# Altium schematic sheet SIM7600G-H_USB.SchDoc
size A; SheetNumber: 25; SheetTotal: 28
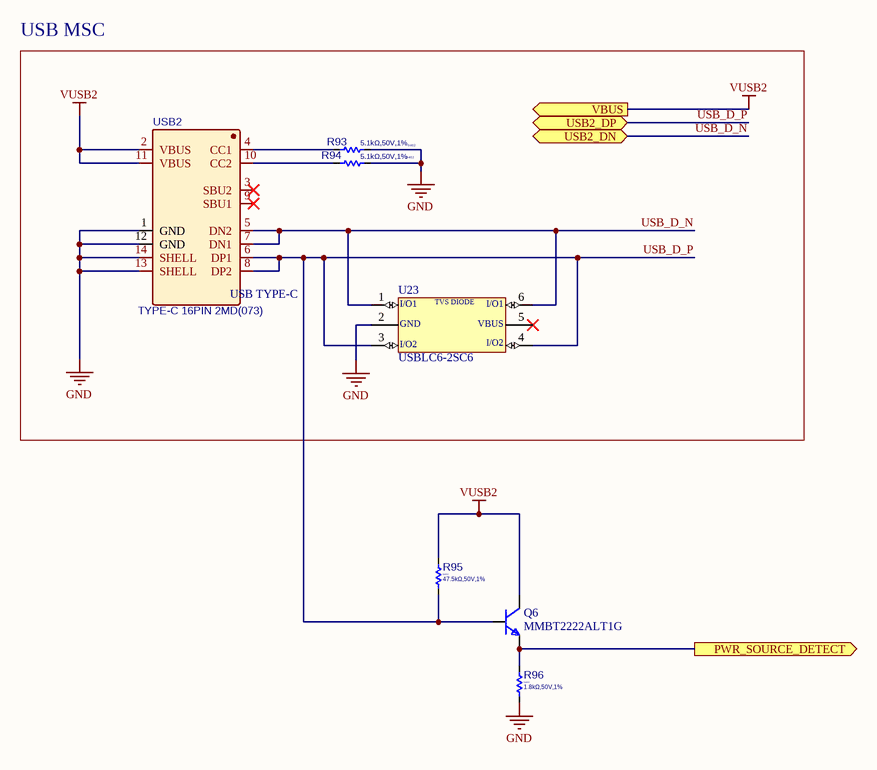
[diagram p0: SIM7600G-H_USB.SchDoc]

## Parts
Q6  MMBT2222ALT1G  [SOT-23]
R93  value 5.1kΩ,50V,1%  Package: 0402  [R0402]  (hidden comment: 5.1KΩ)
R94  value 5.1kΩ,50V,1%  Package: 0402  [R0402]  (hidden comment: 5.1KΩ)
R95  value 47.5kΩ,50V,1%  Package: 0402  [R0402]  (hidden comment: 47.5kΩ)
R96  value 1.8kΩ,50V,1%  Package: 0402  [R0402]  (hidden comment: 1.8kΩ)
U23  USBLC6-2SC6  [SOT95P280X145-6N]
USB2  TYPE-C 16PIN 2MD(073)  [TYPE-C 16PIN 2MD(073)]

## Blocks framed on the sheet
USB MSC: R93 R94 U23 USB2

## Ports
PWR_SOURCE_DETECT (out), USB2_DN (bidir), USB2_DP (bidir), VBUS (out)

## Nets
GND: R93.2 R94.2 R96.1 U23.2(GND) USB2.1(GND) USB2.12(GND) USB2.13(SHELL) USB2.14(SHELL)
VUSB2: Q6.3 R95.2 USB2.2(VBUS) USB2.11(VBUS) ; port VBUS
PWR_SOURCE_DETECT: Q6.2 R96.2 ; port PWR_SOURCE_DETECT
USB_D_N: U23.1(I/O1_IN) U23.6(I/O1_OUT) USB2.5(DN2) USB2.7(DN1) ; port USB2_DN
USB_D_P: Q6.1 R95.1 U23.3(I/O2_IN) U23.4(I/O2_OUT) USB2.6(DP1) USB2.8(DP2) ; port USB2_DP
NetR93_1: R93.1 USB2.4(CC1)
NetR94_1: R94.1 USB2.10(CC2)

Not connected (* = marked no-connect by the designer): U23 5(VBUS)*; USB2 3(SBU2)* 9(SBU1)*

## Notes on the sheet
- (in symbol TYPE-C 16PIN 2MD(073)) USB TYPE-C
- (in symbol USBLC6-2SC6) TVS DIODE; I/O1; I/O2

## Library data of the parts
Q6 = MMBT2222ALT1G: Bipolar (BJT) Transistor NPN 40 V 600 mA 300MHz 225 mW Surface Mount SOT-23-3 (TO-236); Manufacturer: ON Semiconductor; Max Operating Temp: +150°C; Min Operating Temp: -55°C; MPN: MMBT2222ALT1G; Package: SOT-23
R93 R94 = RC0402FR-075K1L: 100mW Thick Film Resistors 75V ±100ppm/℃ ±1% 100kΩ 0603 Chip Resistor - Surface Mount ROHS; Manufacturer: YAGEO; Max Operating Temp: +155; MPN: RC0402FR-075K1L; Type: *; Datasheet: https://datasheet.lcsc.com/lcsc/2304140030_YAGEO-RC0402FR-075K1L_C105872.pdf; Min Operating Temp: -55; LCSC: C105872
R95 = AC0402FR-0747K5L: 62.5mW Thick Film Resistors 50V ±100ppm/℃ ±1% 47.5kΩ 0402 Chip Resistor - Surface Mount ROHS; Manufacturer: YAGEO(国巨); Type: *; MPN: AC0402FR-0747K5L; Max Operating Temp: +155; Min Operating Temp: -55; Datasheet: https://datasheet.lcsc.com/lcsc/2304140030_YAGEO-AC0402FR-0747K5L_C227098.pdf; LCSC: C227098
R96 = 0402WGF1801TCE: 62.5mW Thick Film Resistors 50V ±100ppm/℃ ±1% 1.8kΩ 0402 Chip Resistor - Surface Mount ROHS; Manufacturer: YAGEO; MPN: 0402WGF1801TCE; Max Operating Temp: +155; Min Operating Temp: -55; Datasheet: https://www.lcsc.com/datasheet/lcsc_datasheet_2206010045_UNI-ROYAL-Uniroyal-Elec-0402WGF1801TCE_C25871.pdf; LCSC: C25871
U23 = USBLC6-2SC6: 17V Clamp 5A (8/20Âµs) Ipp Tvs Diode Surface Mount SOT-23-6; MF: STMicroelectronics; Value: *; Package: SOT-23-6 STMicroelectronics; MP: USBLC6-2SC6
USB2 = TYPE-C 16PIN 2MD(073): 5A 1 Surface Mount 16P Female -25℃~+85℃ Type-C SMD USB Connectors ROHS; Manufacturer: SHOU HAN(首韩); LCSC: C2765186; Package Reference: TYPE-C 16PIN 2MD(073)